# Altium schematic sheet Sensor_DataS.SchDoc
size A4; Organization: ORGANIZATION; Address1: ADDRESS 1; Address2: ADDRESS 2; Address3: ADDRESS 3; Address4: ADDRESS 4; Revision: -; SheetNumber: 5; SheetTotal: 5; ENG_APP_DATE: --/--/--; DSN_APP_DATE: --/--/--; CHK_APP_DATE: --/--/--
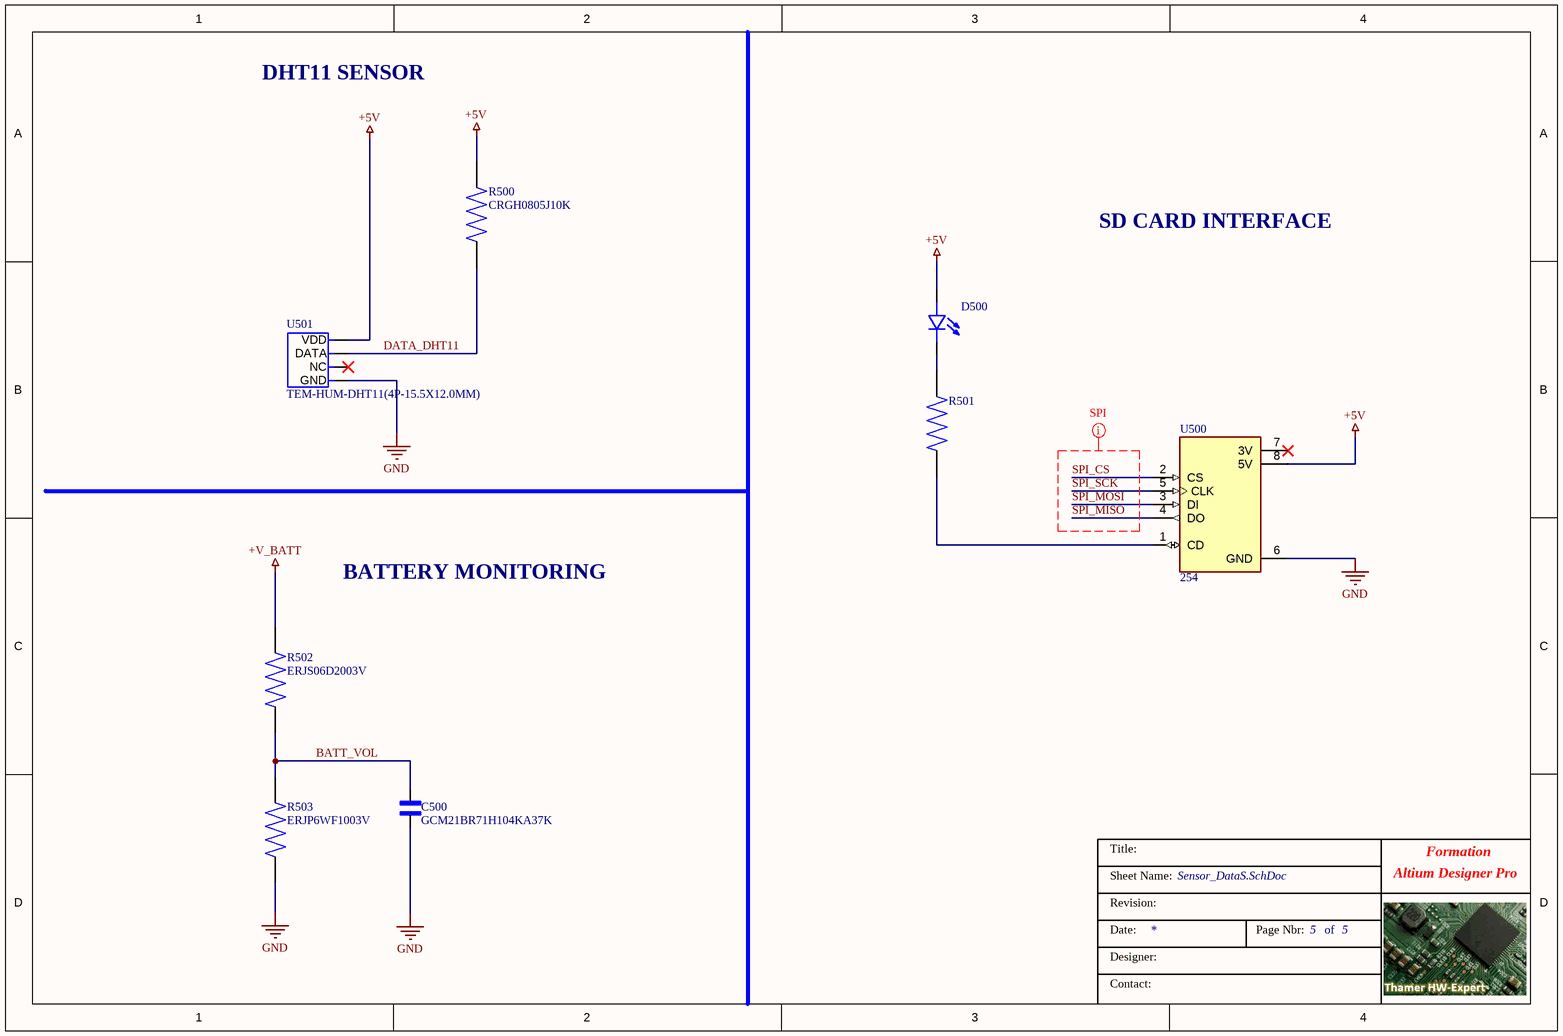
[diagram p0: Sensor_DataS.SchDoc]

## Parts
C500  GCM21BR71H104KA37K  [CAPC2012X135N]
D500  SML-LXT0805GW-TR  [LEDC2012X120N]  (value not drawn)
R500  CRGH0805J10K  [RESC2012X65N]
R501  TNPW0805150RBHEA  [RESC2012X55N]  (value not drawn)
R502  ERJS06D2003V  [RES_ERJS06D2003V]
R503  ERJP6WF1003V  [RESC2012X75N]
U500  254  [MODULE_254]
U501  TEM-HUM-DHT11(4P-15.5X12.0MM)  [SNR4-2.54-15.5X12.0X5.5MM]

## Nets
+5V: D500.A R500.2 U500.8(5V) U501.1(VDD)
+V_BATT: R502.2
GND: C500.2 R503.1 U500.6(GND) U501.4(GND)
BATT_VOL: C500.1 R502.1 R503.2
DATA_DHT11: R500.1 U501.2(DATA)
SPI_CS: U500.2(CS)
SPI_MISO: U500.4(DO)
SPI_MOSI: U500.3(DI)
SPI_SCK: U500.5(CLK)
NetD500_C: D500.C R501.1
NetR501_2: R501.2 U500.1(CD)

Not connected (* = marked no-connect by the designer): U500 7(3V)*; U501 3(NC)*

## Layout directives
net class SPI: SPI_CS, SPI_MISO, SPI_MOSI, SPI_SCK

## Notes on the sheet
- DHT11 SENSOR
- SD CARD INTERFACE
- BATTERY MONITORING
- Title:
- Formation
- Sheet Name:
- Revision:
- Altium Designer Pro
- Date:
- Designer:
- Contact:
- Page Nbr:
- of

## Library data of the parts
C500 = GCM21BR71H104KA37K: .1UF 50V 10% 080; MF: {'manufacturer': u'Murata'}; Package: None; Price: None; Value: *; MP: GCM21BR71H104KA37K; Availability: Unavailable
D500 = SML-LXT0805GW-TR: Surface Mount LED Lamps 0805 Thin PCB Green <a href="https://pricing.snapeda.com/parts/SML-LXT0805GW-TR/Lumex%20Opto/Components%20Inc./view-part?ref=eda">Check availability</a>; MF: {'manufacturer': u'Lumex Opto/Components'}; Package: None; Price: None; Value: *; MP: SML-LXT0805GW-TR; Availability: Unavailable
R500 = CRGH0805J10K: Res Thick Film 0805 10K Ohm 5% 1/3W Â±100ppm/Â°C Molded SMD SMD T/R; MF: {'manufacturer': u'TE Connectivity'}; Package: None; Price: None; Value: *; MP: CRGH0805J10K; Availability: Unavailable
R501 = TNPW0805150RBHEA: MF: {'manufacturer': u'Vishay'}; Package: None; Price: None; Value: *; MP: TNPW0805150RBHEA; Availability: Unavailable
R502 = ERJS06D2003V: MF: {'manufacturer': u'Panasonic'}; Package: None; Price: None; Value: *; MP: ERJS06D2003V; Availability: Unavailable
R503 = ERJP6WF1003V: 100K OHM 1% 1/2W; MF: {'manufacturer': u'Panasonic'}; Package: None; Price: None; Value: *; MP: ERJP6WF1003V; Availability: Unavailable
U500 = 254: MF: {'manufacturer': u'Adafruit'}; Package: None; Price: None; Value: *; MP: 254; Availability: Unavailable
U501 = TEM-HUM-DHT11(4P-15.5X12.0MM): 314010000; MF: {'manufacturer': u'UNIVERSAL-SOLDER Electronics Ltd'}; MP: DHT11; Package: None; Price: None; Value: *; Availability: Unavailable